# Altium project PCB_Project.PrjPcb
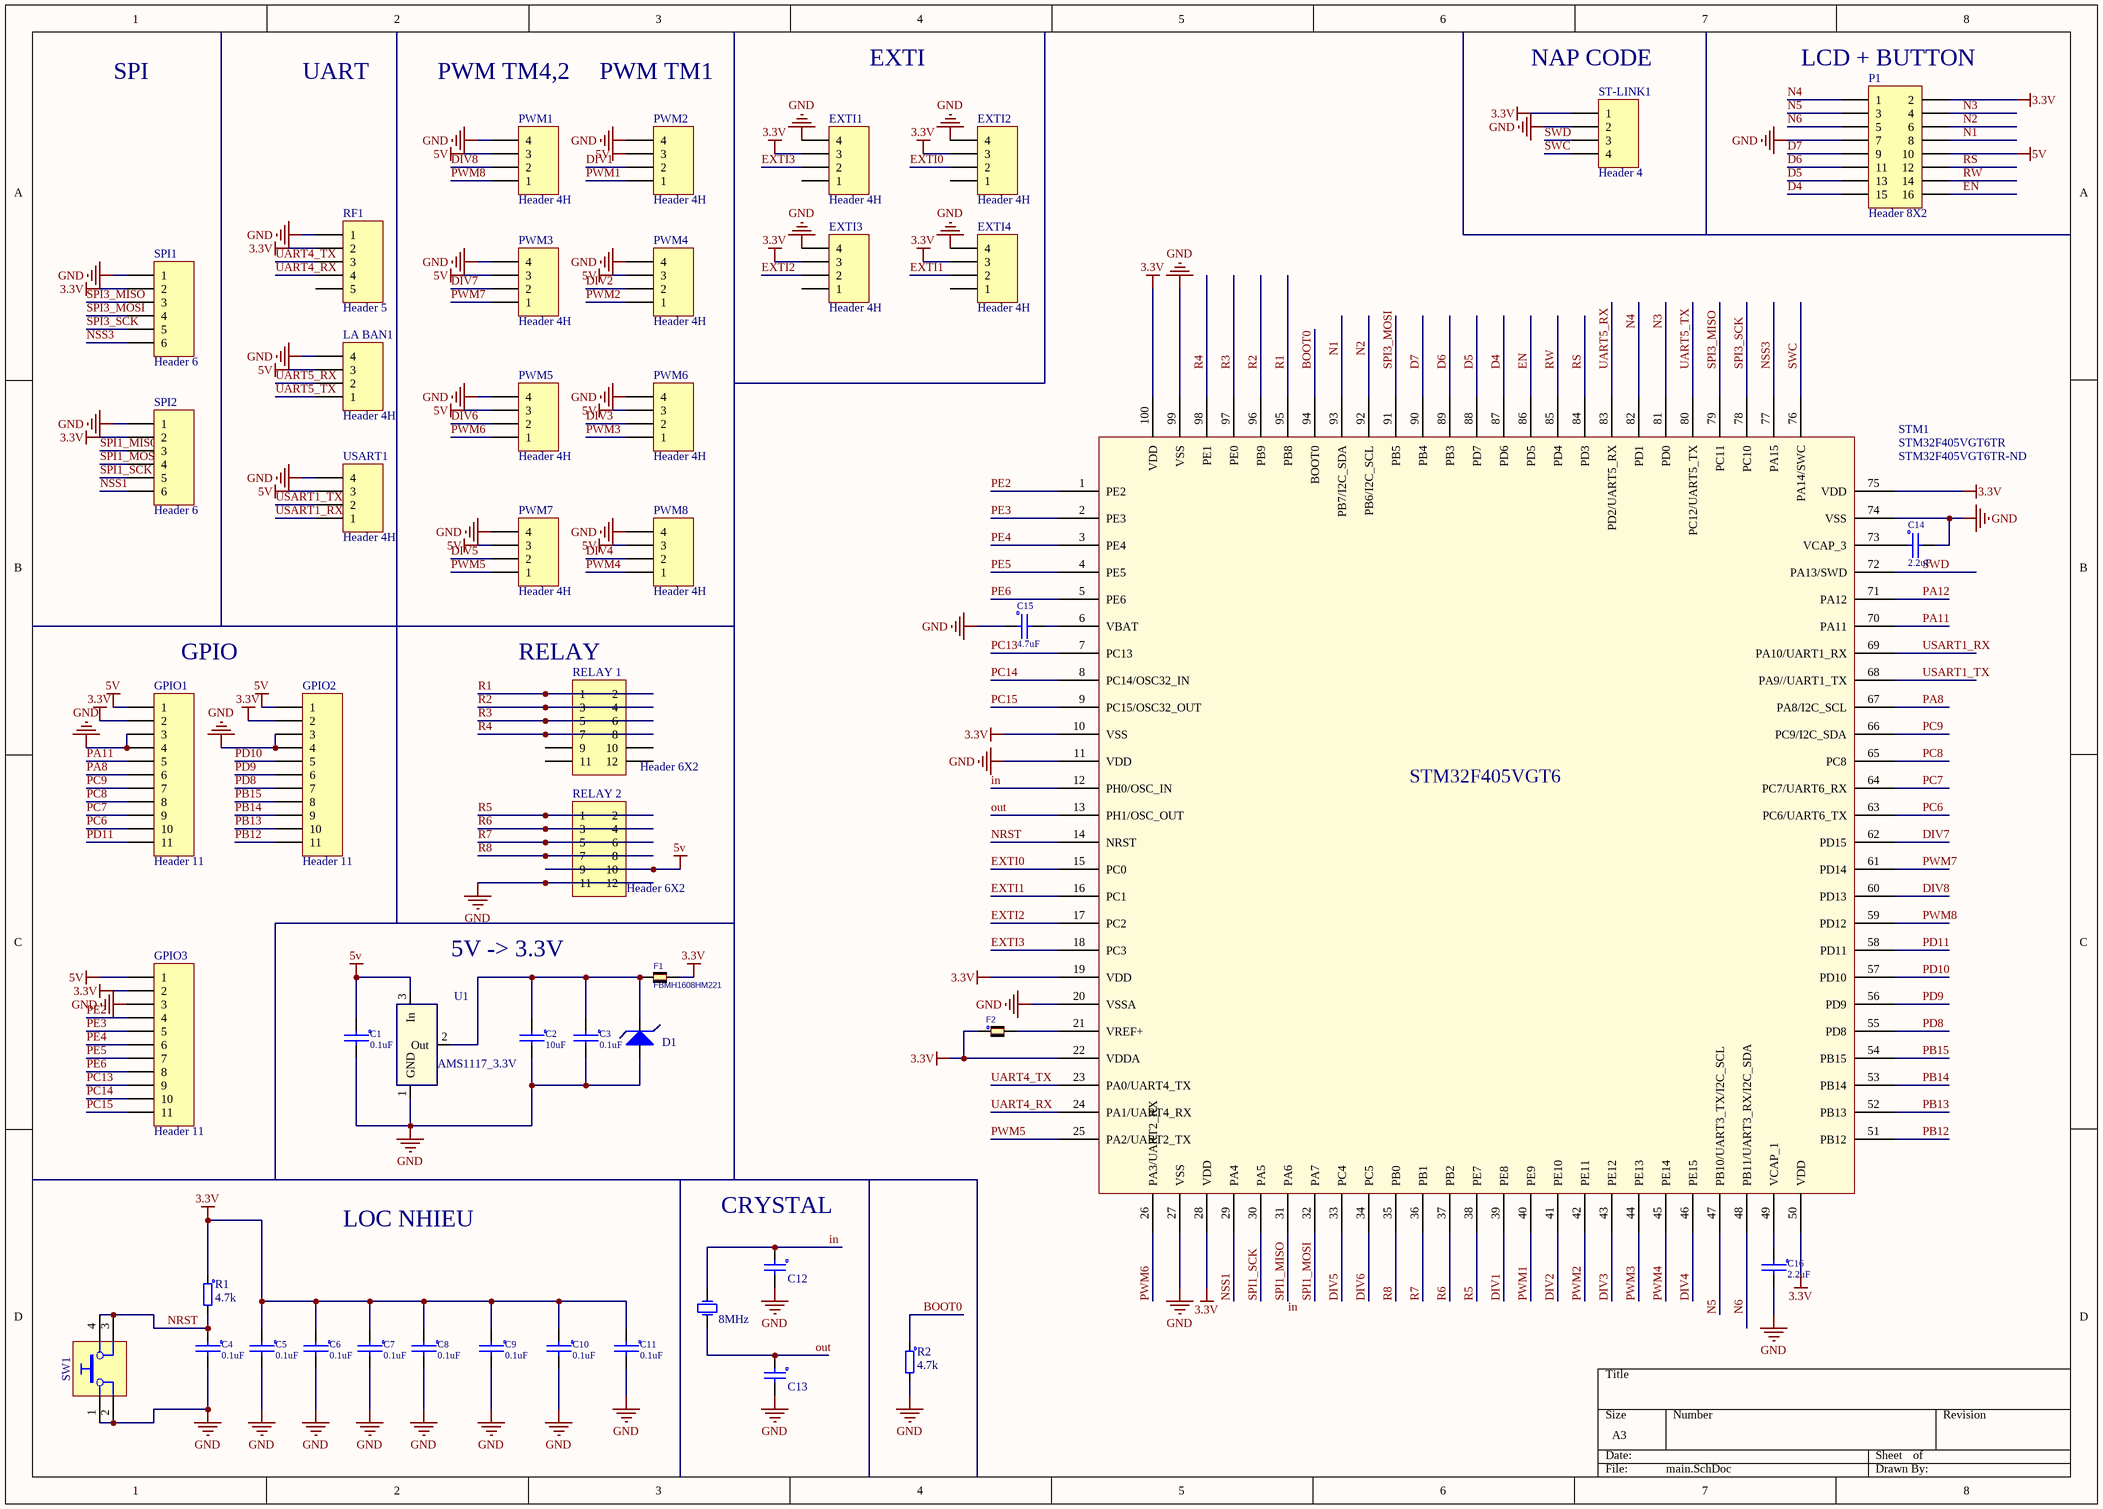
[diagram p0: main.SchDoc]
1 sheet, 49 parts. Net scope: global (net labels, ports and power ports of the same name join across sheets).
Board file: main.PcbDoc

## Sheet main.SchDoc
size A3; PageSetup: Record=PageOptions|CenterHorizontal=True|CenterVertical=True|PrintScale=1.00|XCorrection=1.00|YCorrection=1.00|PrintKind=2|BorderSize=5000000|LeftOffset=0|BottomOffset=0|Orientation=2|PaperLength=1000|PaperWidth=1000|Scale=100|PaperSource=7|PrintQuality=-3|MediaType=1|DitherType=10|PaperKind=A3|PrintScaleMode=0

### Parts
C1  0.1uF  [C0805]
C2  10uF  [C0805]
C3  0.1uF  [C0805]
C4  0.1uF  [C0805]
C5  0.1uF  [C0805]
C6  0.1uF  [C0805]
C7  0.1uF  [C0805]
C8  0.1uF  [C0805]
C9  0.1uF  [C0805]
C10  0.1uF  [C0805]
C11  0.1uF  [C0805]
C12  C33pf 0805  [C0805]  (value not drawn)
C13  C33pf 0805  [C0805]  (value not drawn)
C14  2.2uF  [C0805]
C15  4.7uF  [C0805]
C16  2.2uF  [C0805]
D1  D14V0S1U2WS-7  [SOD323]  (value not drawn)
EXTI1  Header 4H  [HDR1X4H]
EXTI2  Header 4H  [HDR1X4H]
EXTI3  Header 4H  [HDR1X4H]
EXTI4  Header 4H  [HDR1X4H]
F1  FBMH1608HM221  [L0603]
F2  BK1608HM102-T  [L0603]  (value not drawn)
GPIO1  Header 11  [HDR1X11]
GPIO2  Header 11  [HDR1X11]
GPIO3  Header 11  [HDR1X11]
LA_BAN1  Header 4H  [HDR1X4H]
P1  Header 8X2  [HDR2X8]
PWM1  Header 4H  [HDR1X4H]
PWM2  Header 4H  [HDR1X4H]
PWM3  Header 4H  [HDR1X4H]
PWM4  Header 4H  [HDR1X4H]
PWM5  Header 4H  [HDR1X4H]
PWM6  Header 4H  [HDR1X4H]
PWM7  Header 4H  [HDR1X4H]
PWM8  Header 4H  [HDR1X4H]
R1  4.7k  [R0805]
R2  4.7k  [R0805]
RELAY_1  Header 6X2  [HDR2X6]
RELAY_2  Header 6X2  [HDR2X6]
RF1  Header 5  [HDR1X5]
SPI1  Header 6  [HDR1X6]
SPI2  Header 6  [HDR1X6]
ST-LINK1  Header 4  [HDR1X4]
STM1  STM32F405VGT6TR  Supplier Part Number 1: STM32F405VGT6TR-ND  [TSQFP50P1750X1750X160-100N]
SW1  SW-SPST-4P-PTS645SM43SMTR92 LFS  [SW-PTS645SM43SMTR92 LFS]  (value not drawn)
U1  AMS1117_3.3V  [SOT233X180-4N]
USART1  Header 4H  [HDR1X4H]
Y1  8MHz  [XT2]

### Nets
3.3V: C5.1 C6.1 C7.1 C8.1 C9.1 C10.1 C11.1 EXTI1.3 EXTI2.3 EXTI3.3 EXTI4.3 F1.2 F2.1 GPIO1.2 GPIO2.2 GPIO3.2 P1.2 R1.1 RF1.2 SPI1.2 SPI2.2 ST-LINK1.1 STM1.10(VSS) STM1.19(VDD) STM1.22(VDDA) STM1.28(VDD) STM1.50(VDD) STM1.75(VDD) STM1.100(VDD)
5v: C1.1 GPIO1.1 GPIO2.1 GPIO3.1 LA_BAN1.3 P1.10 PWM1.3 PWM2.3 PWM3.3 PWM4.3 PWM5.3 PWM6.3 PWM7.3 PWM8.3 RELAY_2.9 RELAY_2.10 U1.3(In) USART1.3
GND: C1.2 C2.2 C3.2 C4.2 C5.2 C6.2 C7.2 C8.2 C9.2 C10.2 C11.2 C12.2 C13.2 C14.2 C15.1 C16.2 D1.1(A) EXTI1.4 EXTI2.4 EXTI3.4 EXTI4.4 GPIO1.3 GPIO1.4 GPIO2.3 GPIO2.4 GPIO3.3 LA_BAN1.4 P1.7 PWM1.4 PWM2.4 PWM3.4 PWM4.4 PWM5.4 PWM6.4 PWM7.4 PWM8.4 R2.2 RELAY_2.11 RELAY_2.12 RF1.1 SPI1.1 SPI2.1 ST-LINK1.2 STM1.11(VDD) STM1.20(VSSA) STM1.27(VSS) STM1.74(VSS) STM1.99(VSS) SW1.1 SW1.2 U1.1(GND) USART1.4
BOOT0: R2.1 STM1.94(BOOT0)
D4: P1.15 STM1.87(PD6)
D5: P1.13 STM1.88(PD7)
D6: P1.11 STM1.89(PB3)
D7: P1.9 STM1.90(PB4)
DIV1: PWM2.2 STM1.39(PE8)
DIV2: PWM4.2 STM1.41(PE10)
DIV3: PWM6.2 STM1.43(PE12)
DIV4: PWM8.2 STM1.46(PE15)
DIV5: PWM7.2 STM1.33(PC4)
DIV6: PWM5.2 STM1.34(PC5)
DIV7: PWM3.2 STM1.62(PD15)
DIV8: PWM1.2 STM1.60(PD13)
EN: P1.16 STM1.86(PD5)
EXTI0: EXTI2.2 STM1.15(PC0)
EXTI1: EXTI4.2 STM1.16(PC1)
EXTI2: EXTI3.2 STM1.17(PC2)
EXTI3: EXTI1.2 STM1.18(PC3)
in: C12.1 STM1.12(PH0/OSC_IN) Y1.2(OSC2)
N1: P1.8 STM1.93(PB7/I2C_SDA)
N2: P1.6 STM1.92(PB6/I2C_SCL)
N3: P1.4 STM1.81(PD0)
N4: P1.1 STM1.82(PD1)
N5: P1.3 STM1.47(PB10/UART3_TX/I2C_SCL)
N6: P1.5 STM1.48(PB11/UART3_RX/I2C_SDA)
NRST: C4.1 R1.2 STM1.14(NRST) SW1.3 SW1.4
NSS1: SPI2.6 STM1.29(PA4)
NSS3: SPI1.6 STM1.77(PA15)
out: C13.1 STM1.13(PH1/OSC_OUT) Y1.1(OSC1)
PA8: GPIO1.6 STM1.67(PA8/I2C_SCL)
PA11: GPIO1.5 STM1.70(PA11)
PA12: STM1.71(PA12)
PB12: GPIO2.11 STM1.51(PB12)
PB13: GPIO2.10 STM1.52(PB13)
PB14: GPIO2.9 STM1.53(PB14)
PB15: GPIO2.8 STM1.54(PB15)
PC6: GPIO1.10 STM1.63(PC6/UART6_TX)
PC7: GPIO1.9 STM1.64(PC7/UART6_RX)
PC8: GPIO1.8 STM1.65(PC8)
PC9: GPIO1.7 STM1.66(PC9/I2C_SDA)
PC13: GPIO3.9 STM1.7(PC13)
PC14: GPIO3.10 STM1.8(PC14/OSC32_IN)
PC15: GPIO3.11 STM1.9(PC15/OSC32_OUT)
PD8: GPIO2.7 STM1.55(PD8)
PD9: GPIO2.6 STM1.56(PD9)
PD10: GPIO2.5 STM1.57(PD10)
PD11: GPIO1.11 STM1.58(PD11)
PE2: GPIO3.4 STM1.1(PE2)
PE3: GPIO3.5 STM1.2(PE3)
PE4: GPIO3.6 STM1.3(PE4)
PE5: GPIO3.7 STM1.4(PE5)
PE6: GPIO3.8 STM1.5(PE6)
PWM1: PWM2.1 STM1.40(PE9)
PWM2: PWM4.1 STM1.42(PE11)
PWM3: PWM6.1 STM1.44(PE13)
PWM4: PWM8.1 STM1.45(PE14)
PWM5: PWM7.1 STM1.25(PA2/UART2_TX)
PWM6: PWM5.1 STM1.26(PA3/UART2_RX)
PWM7: PWM3.1 STM1.61(PD14)
PWM8: PWM1.1 STM1.59(PD12)
R1: RELAY_1.1 RELAY_1.2 STM1.95(PB8)
R2: RELAY_1.3 RELAY_1.4 STM1.96(PB9)
R3: RELAY_1.5 RELAY_1.6 STM1.97(PE0)
R4: RELAY_1.7 RELAY_1.8 STM1.98(PE1)
R5: RELAY_2.1 RELAY_2.2 STM1.38(PE7)
R6: RELAY_2.3 RELAY_2.4 STM1.37(PB2)
R7: RELAY_2.5 RELAY_2.6 STM1.36(PB1)
R8: RELAY_2.7 RELAY_2.8 STM1.35(PB0)
RS: P1.12 STM1.84(PD3)
RW: P1.14 STM1.85(PD4)
SPI1_MISO: SPI2.3 STM1.31(PA6)
SPI1_MOSI: SPI2.4 STM1.32(PA7)
SPI1_SCK: SPI2.5 STM1.30(PA5)
SPI3_MISO: SPI1.3 STM1.79(PC11)
SPI3_MOSI: SPI1.4 STM1.91(PB5)
SPI3_SCK: SPI1.5 STM1.78(PC10)
SWC: ST-LINK1.4 STM1.76(PA14/SWC)
SWD: ST-LINK1.3 STM1.72(PA13/SWD)
UART4_RX: RF1.4 STM1.24(PA1/UART4_RX)
UART4_TX: RF1.3 STM1.23(PA0/UART4_TX)
UART5_RX: LA_BAN1.2 STM1.83(PD2/UART5_RX)
UART5_TX: LA_BAN1.1 STM1.80(PC12/UART5_TX)
USART1_RX: STM1.69(PA10/UART1_RX) USART1.1
USART1_TX: STM1.68(PA9//UART1_TX) USART1.2
NetC2_1: C2.1 C3.1 D1.2(K) F1.1 U1.2(Out)
NetC14_1: C14.1 STM1.73(VCAP_3)
NetC15_2: C15.2 STM1.6(VBAT)
NetC16_1: C16.1 STM1.49(VCAP_1)
NetF2_2: F2.2 STM1.21(VREF+)

Not connected (* = marked no-connect by the designer): EXTI1 1; EXTI2 1; EXTI3 1; EXTI4 1; RELAY_1 9 10 11 12; RF1 5

### Notes on the sheet
- SPI
- UART
- PWM TM4,2
- PWM TM1
- EXTI
- (near ST-LINK1) NAP CODE
- (near P1) LCD + BUTTON
- (near GPIO1) GPIO
- (near RELAY_1) RELAY
- 5V -> 3.3V
- LOC NHIEU
- (near C12) CRYSTAL
- Labels drawn without touching a wire or pin: in
- (in symbol STM32F405VGTx) STM32F405VGT6

### Library data of the parts
C1 C3-C11 = C0.1uF-0805: 0.1µF ±10% 50V Ceramic Capacitor X7R 0805; Manufacturer: Taiyo Yuden; Manufacturer Part Number: UMK212B7104KG-T; value: 0.1uF; Supplier 1: Digi-Key; RoHS: RoHS Compliant; Category: Capacitors; Stock 1: 39000; Pricing 1: 3000=0.01768, 6000=0.01626, 9000=0.01485, 15000=0.01414, 30000=0.01343, 75000=0.01202, 150000=0.00972 (USD); Packaging: Tape & Reel (TR); Part Status: Active; Capacitance: 0.1µF; Tolerance: ±10%; Voltage - Rated: 50V; Temperature Coefficient: X7R; Operating Temperature: -55°C ~ 125°C; Features: -; Ratings: -; Applications: General Purpose; Mounting Type: Surface Mount, MLCC; Package / Case: 0805 (2012 Metric); Size / Dimension: 0.079" L x 0.049" W (2.00mm x 1.25mm); Height - Seated (Max): -; Thickness (Max): 0.053" (1.35mm); Lead Spacing: -; Lead Style: -; ComponentLink1URL: http://www.yuden.co.jp/productdata/catalog/en/mlcc_all_e.pdf; ComponentLink1Description: http://www.yuden.co.jp/productdata/catalog/en/mlcc_all_e.pdf; Supplier Part Number 1: 587-1279-2-ND
C2 = C10uF_0805: 10µF 6.3V Ceramic Capacitor X5R 0805 (2012 Metric) 0.079" L x 0.049" W (2.00mm x 1.25mm); Manufacturer Part Number: JMK212ABJ106KGHT; Manufacturer: Taiyo Yuden; value: 10uF; Link: http://www.digikey.com/product-detail/en/taiyo-yuden/JMK212ABJ106KGHT/587-3389-2-ND/4157467
C12 C13 = C33pf 0805: 33pF ±1% 50V Ceramic Capacitor C0G, NP0 0805 (2012 Metric); Manufacturer: Yageo; Manufacturer Part Number: CC0805FRNPO9BN330; Notification: Current market demand for these product types have resulted in fluctuating and extending lead times. Lead times may differ.; Supplier 1: Digi-Key; RoHS: RoHS Compliant; Category: Capacitors; Stock 1: 0; Pricing 1: 4000=0.03101 (USD); Packaging: Tape & Reel (TR); Part Status: Active; Tolerance: ±1%; Voltage - Rated: 50V; Temperature Coefficient: C0G, NP0; Operating Temperature: -55°C ~ 125°C; Features: -; Ratings: -; Applications: General Purpose; Failure Rate: -; Mounting Type: Surface Mount, MLCC; Package / Case: 0805 (2012 Metric); Size / Dimension: 0.079" L x 0.049" W (2.00mm x 1.25mm); Height - Seated (Max): -; Thickness (Max): 0.028" (0.70mm); Lead Spacing: -; Lead Style: -; ComponentLink1URL: http://www.yageo.com/documents/recent/UPY-GP_NP0_16V-to-50V_16.pdf; ComponentLink1Description: http://www.yageo.com/documents/recent/UPY-GP_NP0_16V-to-50V_16.pdf; Supplier Part Number 1: 311-4175-2-ND
C14 C16 = C4.7uF_0805: 4.7µF 16V Ceramic Capacitor X7R 0805 (2012 Metric) 0.079" L x 0.049" W (2.00mm x 1.25mm); Manufacturer Part Number: EMK212B7475KG-T; Manufacturer: Taiyo Yuden; value: 4.7uF; Nodify: PTien; link: http://www.digikey.com/product-detail/en/taiyo-yuden/EMK212B7475KG-T/587-2394-2-ND/2178913
C15 = C4.7uF_0805: 4.7µF 16V Ceramic Capacitor X7R 0805 (2012 Metric) 0.079" L x 0.049" W (2.00mm x 1.25mm); Manufacturer Part Number: EMK212B7475KG-T; Manufacturer: Taiyo Yuden; Nodify: PTien; link: http://www.digikey.com/product-detail/en/taiyo-yuden/EMK212B7475KG-T/587-2394-2-ND/2178913; value: 4.7uF
D1 = TVS DIODE 14VWM 26VC SOD323_1: TVS DIODE 14VWM 26VC SOD323; Manufacturer: Diodes Incorporated; Type: Zener; Voltage - Reverse Standoff (Typ): 14V (Max); Voltage - Breakdown (Min): 14.5V; Voltage - Clamping (Max) @ Ipp: 26V; Current - Peak Pulse (10/1000µs): 50A (8/20µs); Power - Peak Pulse: 1300W (1.3kW); Power Line Protection: No; Capacitance @ Frequency: 360pF @ 1MHz; Supplier 1: Digi-Key; Manufacturer Part Number: D14V0S1U2WS-7; RoHS: RoHS Compliant; Category: Circuit Protection; Stock 1: 0; Pricing 1: 3000=0.11286, 6000=0.10659, 15000=0.09719, 30000=0.09092, 75000=0.08151 (USD); Packaging: Tape & Reel (TR); Part Status: Active; Applications: General Purpose; Operating Temperature: -55°C ~ 125°C (TJ); Mounting Type: Surface Mount; Package / Case: SC-76, SOD-323; Supplier Device Package: SOD-323; ComponentLink1URL: https://www.diodes.com/assets/Datasheets/D14V0S1U2WS.pdf; ComponentLink1Description: https://www.diodes.com/assets/Datasheets/D14V0S1U2WS.pdf; Supplier Part Number 1: D14V0S1U2WS-7DITR-ND
EXTI1-EXTI4 LA_BAN1 PWM1-PWM8 USART1 = Header 4H: Header, 4-Pin, Right Angle; LatestRevisionDate: 17-Jul-2002; LatestRevisionNote: Re-released for DXP Platform.; Publisher: Altium Limited
F1 = FBMH1608HM221: Manufacturer: Taiyo Yuden; Manufacturer Part Number: FBMH1608HM221-T; Filter Type: Power Line; Number of Lines: 1; Impedance @ Frequency: 220 Ohm @ 100MHz; Current Rating (Max): 1.8A; DC Resistance (DCR) (Max): 70 mOhm; Supplier 1: Digi-Key; RoHS: RoHS Compliant; Category: Filters; Stock 1: 32000; Pricing 1: 4000=0.0224, 8000=0.0203, 12000=0.0196, 28000=0.0182 (USD); Packaging: Tape & Reel (TR); Part Status: Active; Ratings: -; Operating Temperature: -40°C ~ 125°C; Package / Case: 0603 (1608 Metric); Mounting Type: Surface Mount; Height (Max): 0.035" (0.90mm); Size / Dimension: 0.063" L x 0.031" W (1.60mm x 0.80mm); ComponentLink1URL: http://ds.yuden.co.jp/TYCOMPAS/ut/detail.do?productNo=FBMH1608HM221-T&fileName=FBMH1608HM221-T_SS&mode=specSheetDownload; ComponentLink1Description: http://ds.yuden.co.jp/TYCOMPAS/ut/detail.do?productNo=FBMH1608HM221-T&fileName=FBMH1608HM221-T_SS&mode=specSheetDownload; Supplier Part Number 1: 587-1741-2-ND
F2 = FERRITE: 1 KOHM 0603 1LN; Manufacturer: Taiyo Yuden; Temparature: -55°C ~ 125°C; Value: 220 Ohm @ 100MHz; Category: Ferrite bed; Mounting Type: Surface Mount; Package Type: 0603 (1608 Metric; Manufacturer Part Number: BK1608HM102-T; Package Reference: *; Temperture Coefficient: *; Dimension: 0.063" L x 0.031" W (1.60mm x 0.80mm); Voltage: *; Link: http://www.digikey.com/product-detail/en/taiyo-yuden/BK1608HM102-T/587-1862-2-ND/957739
GPIO1-GPIO3 = Header 11: Header, 11-Pin; LatestRevisionDate: 17-Jul-2002; LatestRevisionNote: Re-released for DXP Platform.; Publisher: Altium Limited
P1 = Header 8X2: Header, 8-Pin, Dual row; LatestRevisionDate: 17-Jul-2002; LatestRevisionNote: Re-released for DXP Platform.; Publisher: Altium Limited
R1 R2 = R4.7k_0805: 4.7k Ohm ±1% 0.125W, 1/8W Surface Mount Resistor Thick Film ±100ppm/°C 0805; Manufacturer Part Number: RC0805FR-074K7L; Manufacturer: Yageo; Money/1: 0.1; Value: 4.7k; Link: http://www.digikey.com/product-detail/en/panasonic-electronic-components/ERJ-6ENF4701V/P4.70KCCT-ND/1746872; Supplier 1: Digi-Key; RoHS: RoHS Compliant; Category: Resistors; Stock 1: 5000; Pricing 1: 5000=0.0045, 10000=0.00391, 25000=0.00344, 50000=0.00315, 125000=0.00309 (USD); Packaging: Tape & Reel (TR); Part Status: Active; Resistance (Ohms): 4.7k; Tolerance: ±1%; Power (Watts): 0.125W, 1/8W; Composition: Thick Film; Features: Automotive AEC-Q200, Moisture Resistant; Temperature Coefficient: ±100ppm/°C; Operating Temperature: -55°C ~ 155°C; Package / Case: 0805 (2012 Metric); Supplier Device Package: 0805; Size / Dimension: 0.079" L x 0.049" W (2.00mm x 1.25mm); Height - Seated (Max): 0.024" (0.60mm); Number of Terminations: 2; Failure Rate: -; ComponentLink1URL: http://www.yageo.com/documents/recent/PYu-AC_51_RoHS_L%205.pdf; ComponentLink1Description: http://www.yageo.com/documents/recent/PYu-AC_51_RoHS_L%205.pdf; Supplier Part Number 1: YAG3738TR-ND
RELAY_1 RELAY_2 = Header 6X2: Header, 6-Pin, Dual row; LatestRevisionDate: 17-Jul-2002; LatestRevisionNote: Re-released for DXP Platform.; Publisher: Altium Limited
RF1 = Header 5: Header, 5-Pin; LatestRevisionDate: 17-Jul-2002; LatestRevisionNote: Re-released for DXP Platform.; Publisher: Altium Limited
SPI1 SPI2 = Header 6: Header, 6-Pin; LatestRevisionDate: 17-Jul-2002; LatestRevisionNote: Re-released for DXP Platform.; Publisher: Altium Limited
ST-LINK1 = Header 4: Header, 4-Pin; LatestRevisionDate: 17-Jul-2002; LatestRevisionNote: Re-released for DXP Platform.; Publisher: Altium Limited
STM1 = STM32F405VGTx: MCU 32BIT 1MB FLASH 100LQFP; Manufacturer: STMicroelectronics; Core Processor: ARM® Cortex®-M4; Core Size: 32-Bit; Speed: 168MHz; Connectivity: CAN, EBI/EMI, I²C, IrDA, LIN, SPI, UART/USART, USB OTG; Peripherals: Brown-out Detect/Reset, DMA, I²S, LCD, POR, PWM, WDT; Number of I/O: 82; Program Memory Size: 1MB (1M x 8); RAM Size: 192K x 8; Voltage - Supply (Vcc/Vdd): 1.8 V ~ 3.6 V; Data Converters: A/D 16x12b, D/A 2x12b; Oscillator Type: Internal; Supplier 1: Digi-Key; Manufacturer Part Number: STM32F405VGT6TR; RoHS: RoHS Compliant; Category: Integrated Circuits (ICs); Stock 1: 0; Pricing 1: 1000=9.67841 (USD); Packaging: Tape & Reel (TR); Part Status: Active; Program Memory Type: FLASH; EEPROM Size: -; Operating Temperature: -40°C ~ 85°C (TA); Package / Case: 100-LQFP; Supplier Device Package: 100-LQFP (14x14); ComponentLink1URL: http://www.st.com/content/ccc/resource/technical/document/datasheet/ef/92/76/6d/bb/c2/4f/f7/DM00037051.pdf/files/DM00037051.pdf/jcr:content/translations/en.DM00037051.pdf; ComponentLink1Description: http://www.st.com/content/ccc/resource/technical/document/datasheet/ef/92/76/6d/bb/c2/4f/f7/DM00037051.pdf/files/DM00037051.pdf/jcr:content/translations/en.DM00037051.pdf
SW1 = SW-SPST-4P-PTS645SM43SMTR92 LFS: Tactile Switch SPST-NO Top Actuated Surface Mount; Manufacturer: ITT /  C&K Components; Mechanical Life: 100000Cycles; Actuator Material: Nylon,Polyamide; Max Voltage Rating (DC): 12V; Throw Configuration: SPST; Operating Force: 160gf; Contact Resistance: 100mR; Max Current Rating: 50mA; Illumination Type: Non-Illuminated,Illuminated; Actuator Length: 0.85mm; Supplier 1: Digikey; Manufacturer Part Number: PTS645SM43SMTR92LFS; Stock 1: 442284; Pricing 1: 1=0.15, 10=0.147, 25=0.1416, 50=0.1366, 100=0.129, 250=0.1214, 500=0.1164 (USD); Mount: Surface Mount; Case/Package: SMD/SMT; Contact Plating: Silver; Contact Material: Silver; Colour: Black; Min Operating Temperature: -20°C; Max Operating Temperature: 60°C; Packaging: Tape and Reel; Termination: Gull Wing; Package Quantity: 1000; Current Rating: 50mA; Voltage Rating (DC): 12V; Orientation: Straight; Length: 6mm; Depth: 9mm; Lead Free: Lead Free; REACH SVHC: No SVHC; ComponentLink1URL: https://datasheet.ciiva.com/29931/getdatasheetpartid-764615-29931183.pdf; ComponentLink1Description: https://datasheet.ciiva.com/29931/getdatasheetpartid-764615-29931183.pdf; ComponentLink2URL: https://datasheet.ciiva.com/29903/getdatasheetpartid-786341-29903846.pdf; ComponentLink2Description: https://datasheet.ciiva.com/29903/getdatasheetpartid-786341-29903846.pdf; ComponentLink3URL: https://datasheet.ciiva.com/14920/pts645-14920734.pdf; ComponentLink3Description: https://datasheet.ciiva.com/14920/pts645-14920734.pdf; ComponentLink4URL: https://datasheet.ciiva.com/14920/pts645-14920735.pdf; ComponentLink4Description: https://datasheet.ciiva.com/14920/pts645-14920735.pdf; ComponentLink5URL: https://datasheet.ciiva.com/14920/pts645-14920733.pdf; ComponentLink5Description: https://datasheet.ciiva.com/14920/pts645-14920733.pdf; Supplier Part Number 1: CKN9112CT-ND
U1 = AMS1117_3.3V: Linear Voltage Regulator IC Positive Fixed 1 Output 3.3V 800mA SOT-223-4; Manufacturer: Texas Instruments; Manufacturer Part Number: LM1117MPX-3.3/NOPB; Voltage - Input (Max): 15V; Voltage Dropout (Max): 1.2V @ 800mA; PSRR: 75dB (120Hz); Protection Features: Over Current, Over Temperature; Supplier 1: Digi-Key; RoHS: RoHS Compliant; Category: Integrated Circuits (ICs); Stock 1: 14000; Pricing 1: 2000=0.4676, 6000=0.44422, 10000=0.42752 (USD); Packaging: Tape & Reel (TR); Part Status: Active; Output Configuration: Positive; Output Type: Fixed; Voltage - Output (Min/Fixed): 3.3V; Voltage - Output (Max): -; Current - Output: 800mA; Control Features: -; Operating Temperature: 0°C ~ 125°C; Mounting Type: Surface Mount; Package / Case: TO-261-4, TO-261AA; Supplier Device Package: SOT-223-4; Base Part Number: LM1117; ComponentLink1URL: http://www.ti.com/lit/ds/symlink/lm1117.pdf; ComponentLink1Description: http://www.ti.com/lit/ds/symlink/lm1117.pdf; Supplier Part Number 1: LM1117MPX-3.3/NOPBTR-ND
Y1 = Crystal: Crystal Oscillator; Published: 8-Jun-2000; LatestRevisionDate: 17-Jul-2002; LatestRevisionNote: Re-released for DXP Platform.; PackageReference: R38; Publisher: Altium Limited